# Altium schematic sheet TYPEC.SchDoc
size A; SheetNumber: 4; SheetTotal: 6
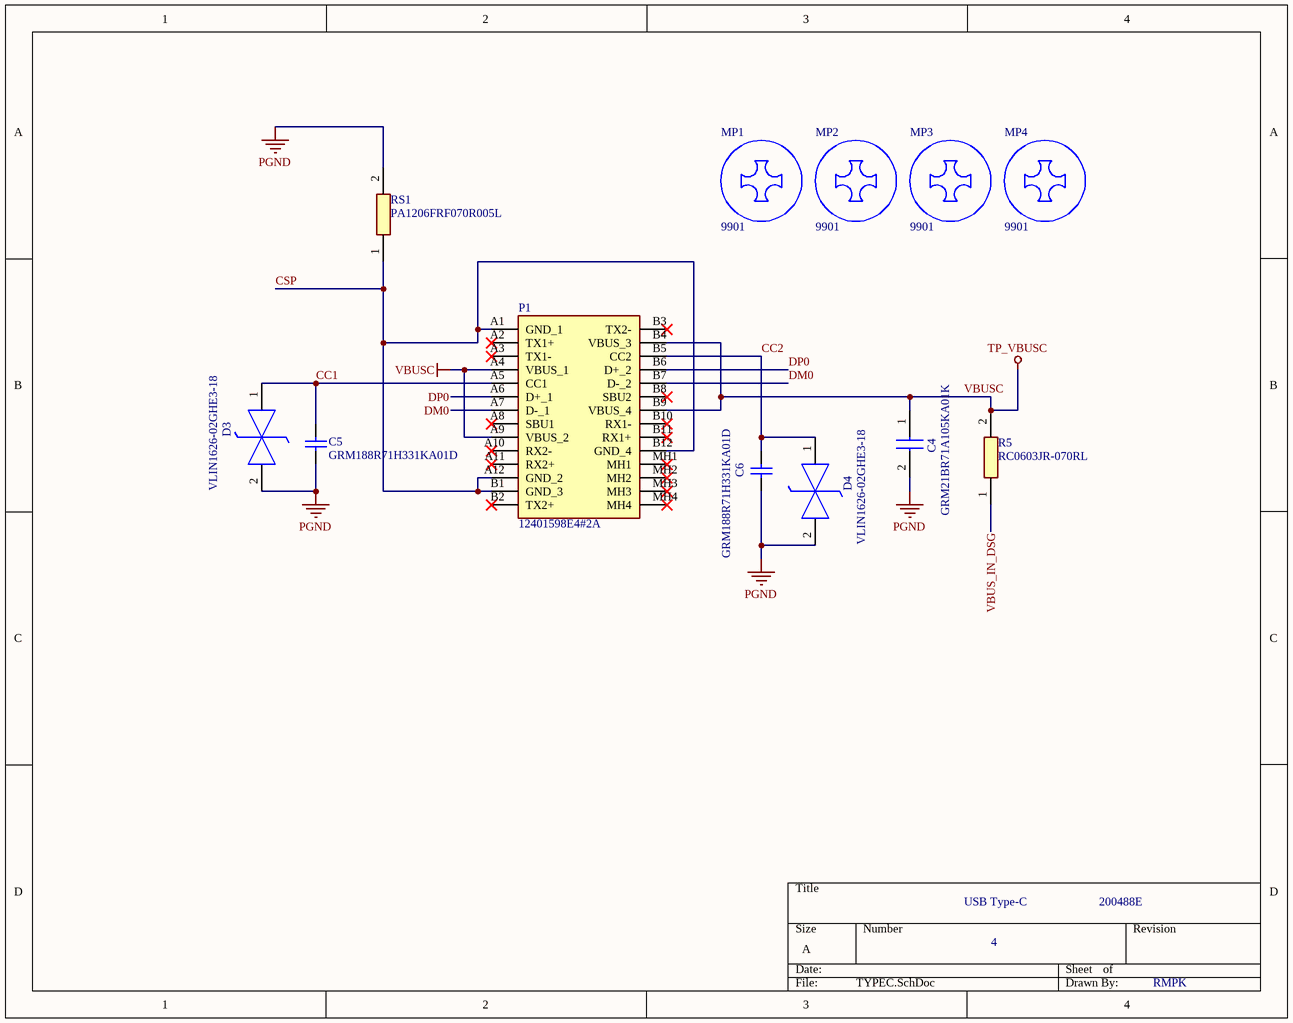
[diagram p0: TYPEC.SchDoc]

## Parts
C4  GRM21BR71A105KA01K  [CAPC2012X145N]
C5  GRM188R71H331KA01D  [CAPC1608X90X35NL10T15]
C6  GRM188R71H331KA01D  [CAPC1608X90X35NL10T15]
D3  VLIN1626-02GHE3-18  [SOD2713X115N]
D4  VLIN1626-02GHE3-18  [SOD2713X115N]
MP1  9901  [FP-9901-MFG]
MP2  9901  [FP-9901-MFG]
MP3  9901  [FP-9901-MFG]
MP4  9901  [FP-9901-MFG]
P1  12401598E4#2A  [12401598E42A]
R5  RC0603JR-070RL  [RESC1608X55N]
RS1  PA1206FRF070R005L  [RESC3216X65N]

## Nets
PGND: C4.2 C5.1 C6.1 D3.2(K2) D4.2(K2) RS1.2
VBUSC: C4.1 P1.A4(VBUS_1) P1.A9(VBUS_2) P1.B4(VBUS_3) P1.B9(VBUS_4) R5.2  [also labelled TP_VBUSC]
CC1: C5.2 D3.1(K1) P1.A5(CC1)
CC2: C6.2 D4.1(K1) P1.B5(CC2)
CSP: P1.A1(GND_1) P1.A12(GND_2) P1.B1(GND_3) P1.B12(GND_4) RS1.1
DM0: P1.A7(D-_1) P1.B7(D-_2)
DP0: P1.A6(D+_1) P1.B6(D+_2)
VBUS_IN_DSG: R5.1

Not connected (* = marked no-connect by the designer): P1 A2(TX1+)* A3(TX1-)* A8(SBU1)* A10(RX2-)* A11(RX2+)* B2(TX2+)* B3(TX2-)* B8(SBU2)* B10(RX1-)* B11(RX1+)* MH1* MH2* MH3* MH4*

## Notes on the sheet
- USB Type-C
- 200488E
- 4
- RMPK

## Library data of the parts
C4 = GRM21BR71A105KA01K: Capacitor; Manufacturer_Name: Murata Electronics; Datasheet Link: http://www.murata.com/~/media/webrenewal/support/library/catalog/products/capacitor/mlcc/c02e.pdf; Height: 1.45mm; Manufacturer_Part_Number: GRM21BR71A105KA01K; Mouser Part Number: 81-GRM40X105K10K; Mouser Price/Stock: https://www.mouser.co.uk/ProductDetail/Murata-Electronics/GRM21BR71A105KA01K?qs=Rc6BINVvJ%2FiXBniUY2d%2FOg%3D%3D; Arrow Part Number: GRM21BR71A105KA01K; Arrow Price/Stock: https://www.arrow.com/en/products/grm21br71a105ka01k/murata-manufacturing
C5 C6 = CMP-2006-02914-1: Manufacturer: Murata; Part Number: GRM188R71H331KA01D
D3 D4 = VLIN1626-02GHE3-18: Diode ESD (Bi-directional); Manufacturer_Name: Vishay; Datasheet Link: https://www.mouser.com/datasheet/2/427/vlin1626_02g-1767732.pdf; Height: 1.15mm; Manufacturer_Part_Number: VLIN1626-02GHE3-18; Mouser Part Number: 78-VLIN1626-02GHE318; Mouser Price/Stock: https://www.mouser.co.uk/ProductDetail/Vishay-Semiconductors/VLIN1626-02GHE3-18?qs=nIjV%252BW72yUtWws5A0kqvDg%3D%3D
MP1-MP4 = CMP-19664-000002-1: MACHINE SCREW PAN PHILLIPS 4-40; Head Height: 0.065inch; Thread Size: #4-40; Outside Diameter: 0.212inch; Material: Stainless Steel; Lead Free: Lead Free; Series: -; Package Quantity: 100; Length: 0.44inch; Mount: Screw
P1 = 12401598E4#2A: Connector; Manufacturer_Name: Amphenol Communications Solutions; Datasheet Link: https://cdn.amphenol-icc.com/media/wysiwyg/files/drawing/12401598xxx2a.pdf; Height: 3.43mm; Manufacturer_Part_Number: 12401598E4#2A; Mouser Part Number: 523-12401598E4#2A; Mouser Price/Stock: https://www.mouser.co.uk/ProductDetail/Amphenol-Commercial-Products/12401598E42A?qs=367PjNmvCmllVMBVyIyS3w%3D%3D; Arrow Part Number: 12401598E4#2A; Arrow Price/Stock: https://www.arrow.com/en/products/12401598e42a/amphenol-fci?region=nac
R5 = RC0603JR-070RL: Resistor; Manufacturer_Name: YAGEO; Datasheet Link: https://componentsearchengine.com/Datasheets/2/RC0603JR-070RL.pdf; Height: 0.55mm; Manufacturer_Part_Number: RC0603JR-070RL; Mouser Part Number: 603-RC0603JR-070RL; Mouser Price/Stock: https://www.mouser.co.uk/ProductDetail/YAGEO/RC0603JR-070RL?qs=2cAdsCoAWRGWyPcuXgGiXQ%3D%3D; Arrow Part Number: RC0603JR-070RL; Arrow Price/Stock: https://www.arrow.com/en/products/rc0603jr-070rl/yageo?region=europe
RS1 = PA1206FRF070R005L: Resistor; Manufacturer_Name: YAGEO; Datasheet Link: https://www.mouser.com/datasheet/2/447/PYu_PA0100_2512_51_RoHS_2-2604383.pdf; Height: 0.65mm; Manufacturer_Part_Number: PA1206FRF070R005L